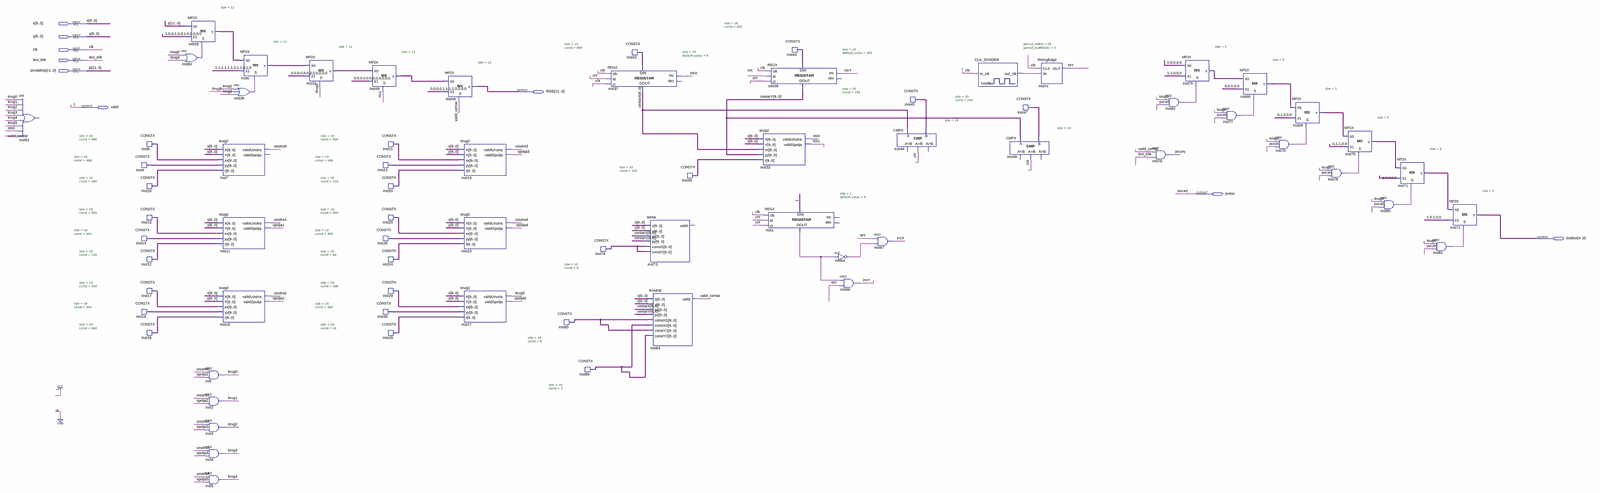
[diagram p0: schematic sheet, whole]
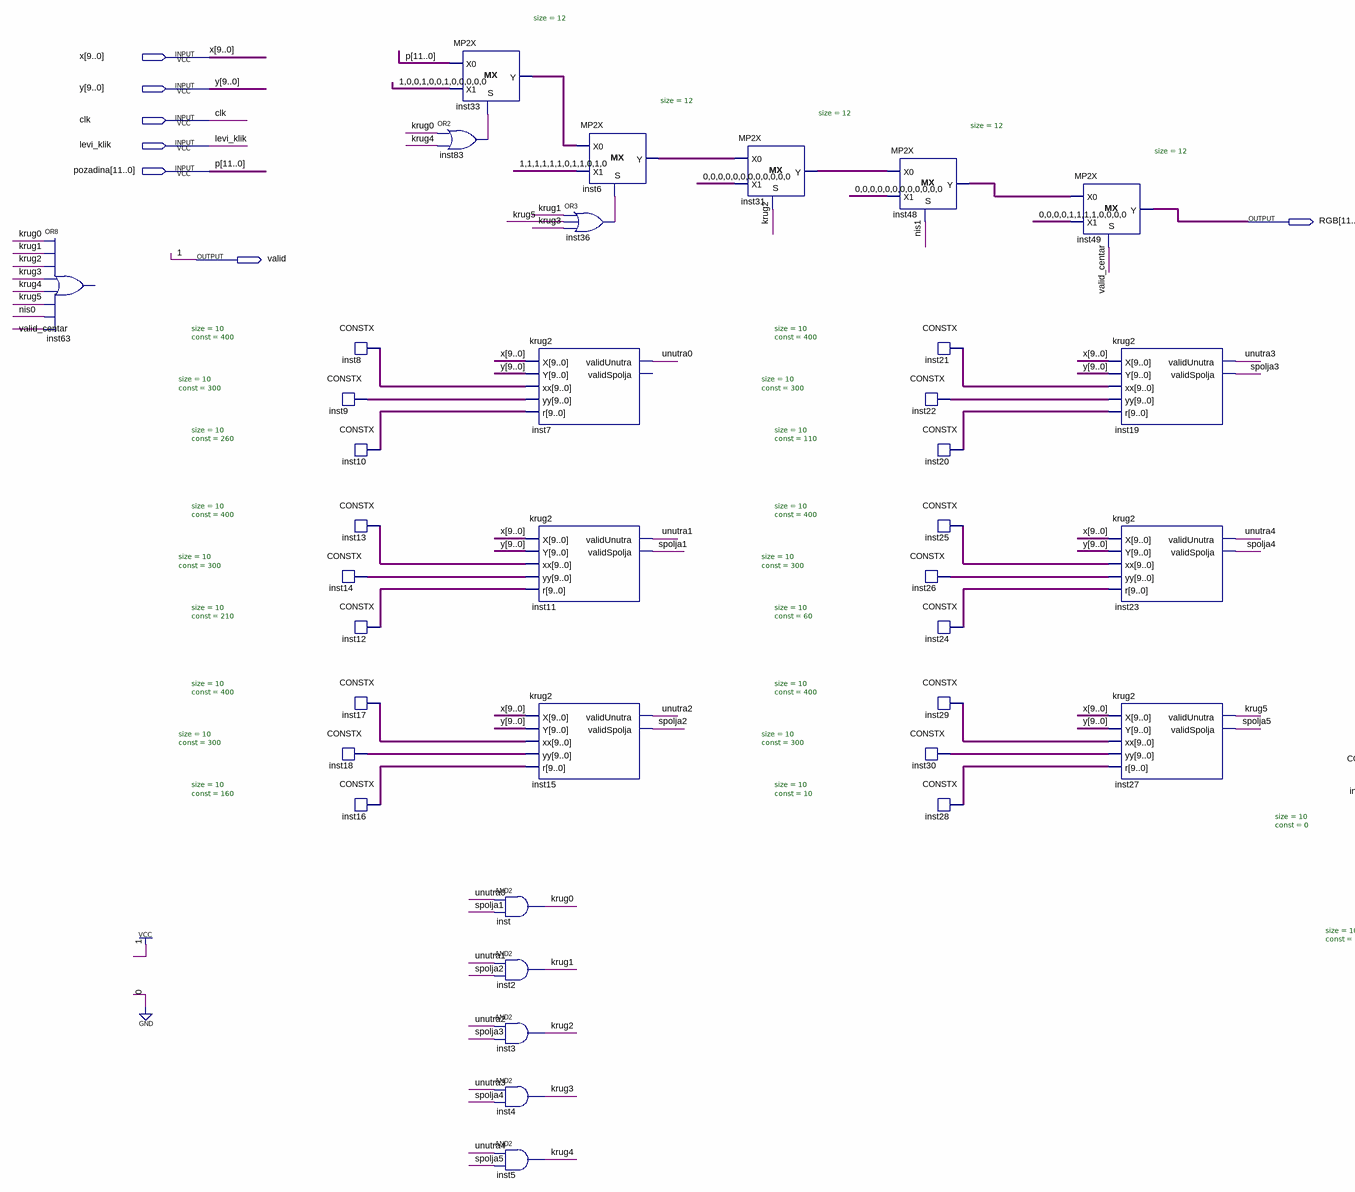
[diagram p1: schematic sheet, left part]
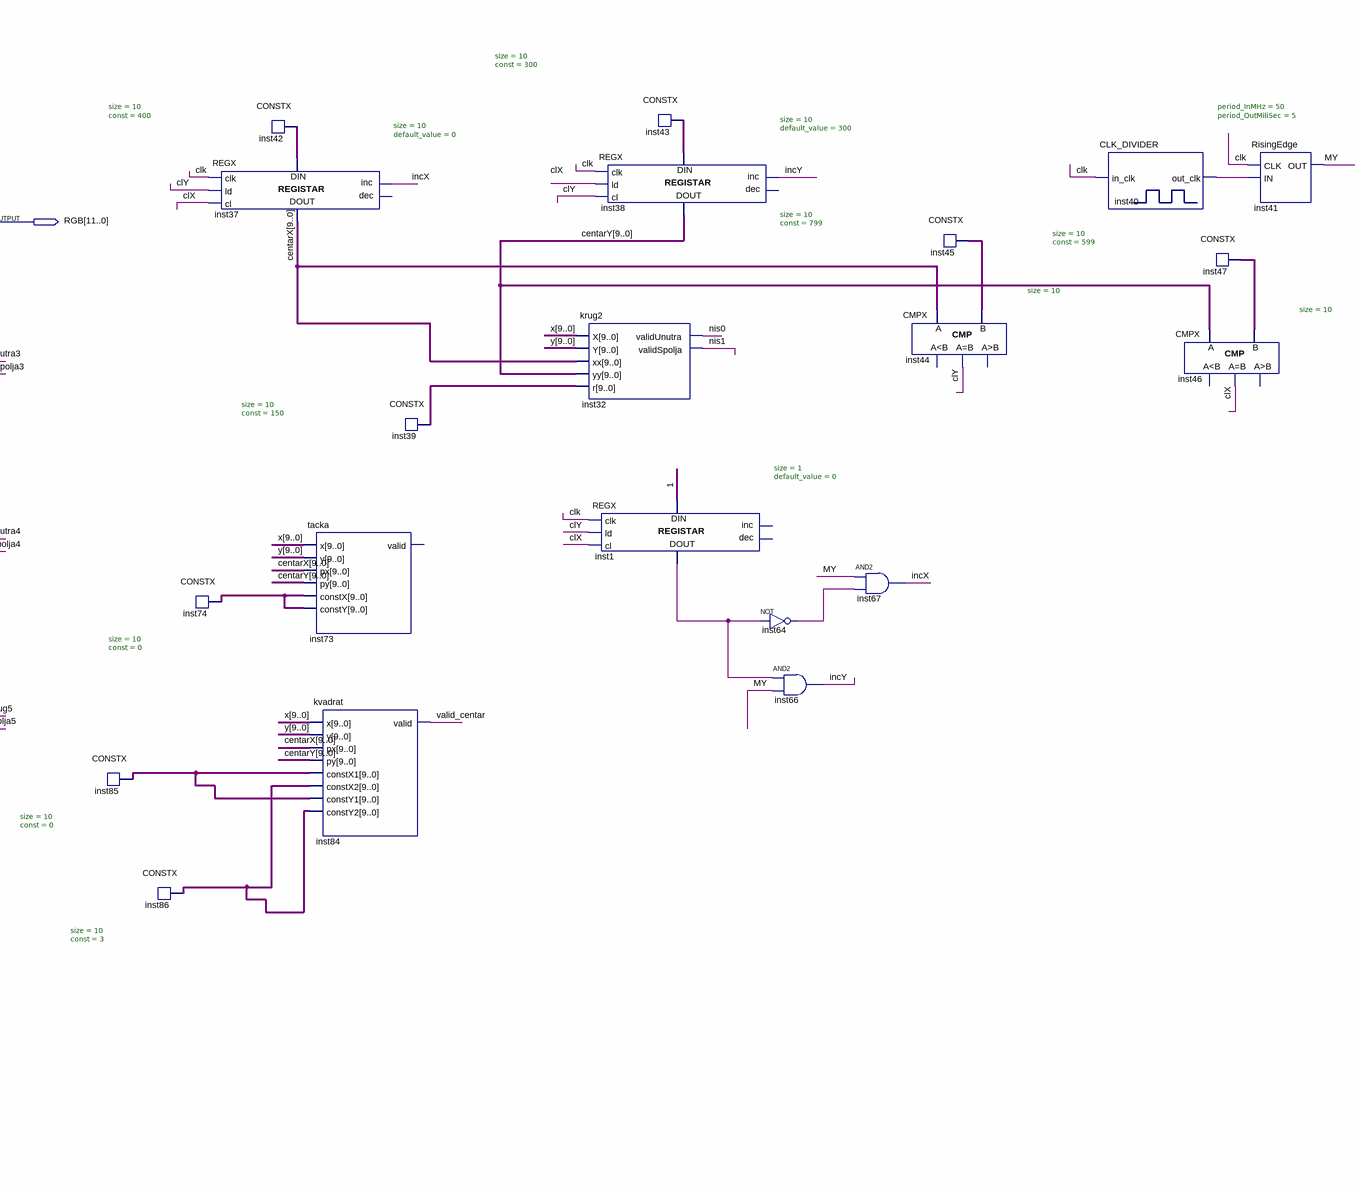
[diagram p2: schematic sheet, centre part]
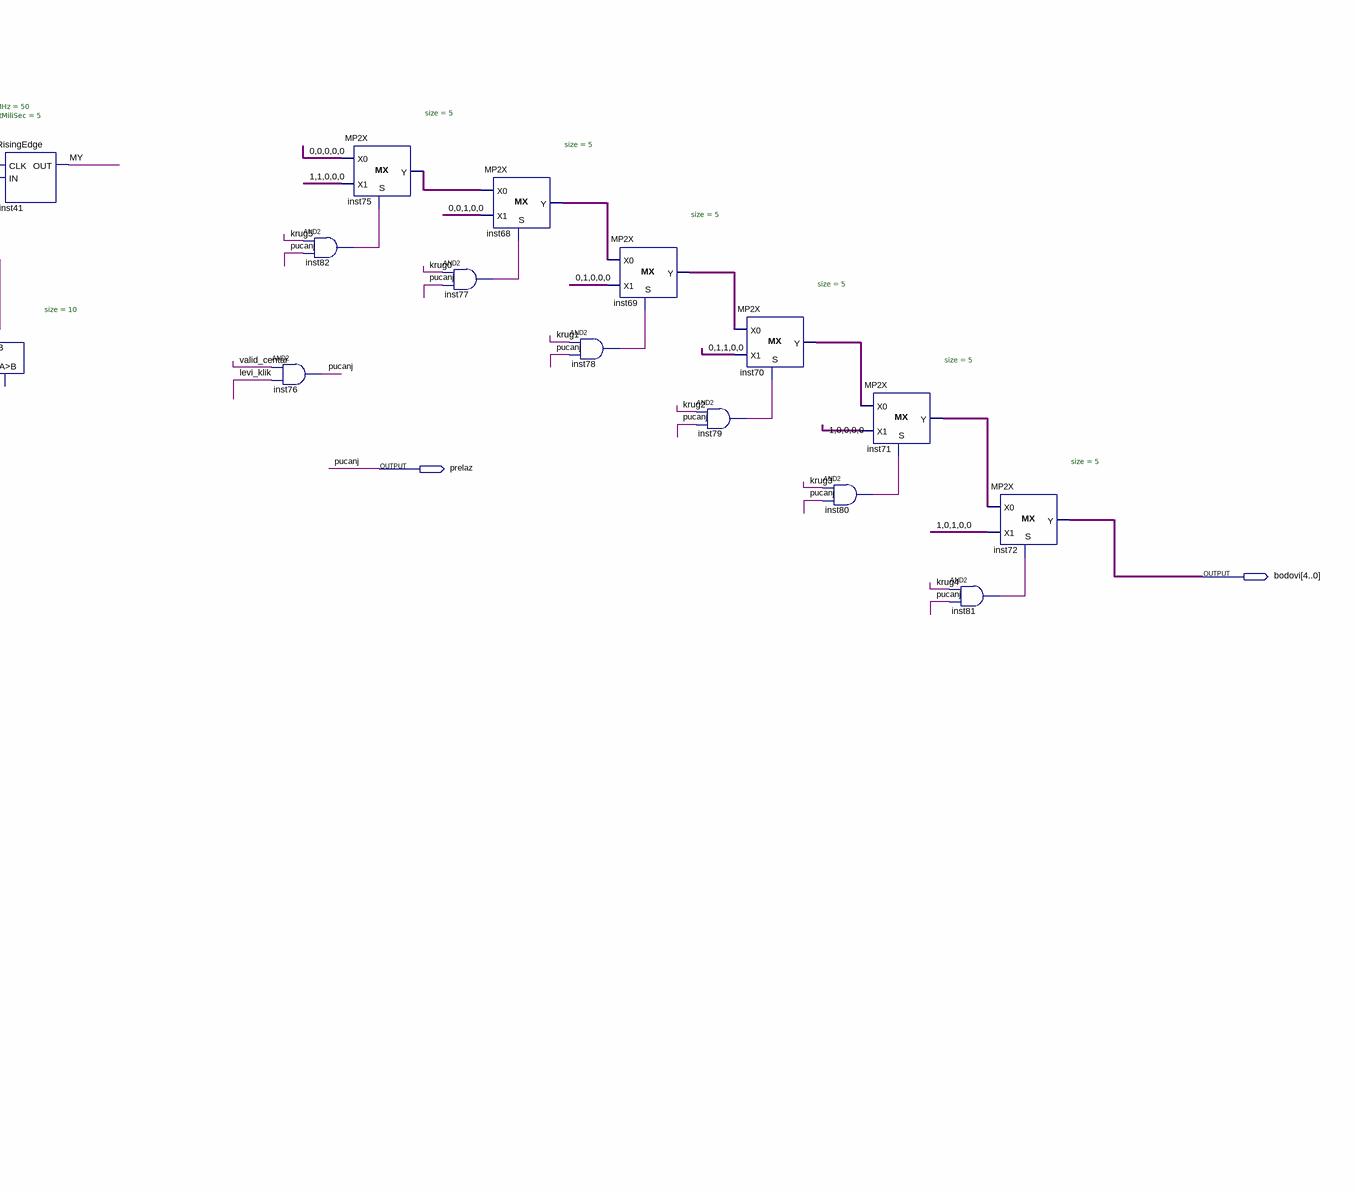
[diagram p3: schematic sheet, right part]
// Quartus schematic sestinivo.bdf as structural Verilog: 71 symbols, 9 pins
module sestinivo (
  input  [9:0] x,
  input  [9:0] y,
  input  clk,
  input  levi_klik,
  input  [11:0] pozadina,
  output [11:0] RGB,
  output valid,
  output prelaz,
  output [4:0] bodovi
);

  wire clX, clY, incX, incY, inst1_data_out, inst36_out, inst40_out_clk, inst64_out, inst77_out, inst78_out,
       inst79_out, inst80_out, inst81_out, inst82_out, inst83_out, krug0, krug1, krug2, krug3, krug4, krug5,
       MY, nis0, nis1, spolja1, spolja2, spolja3, spolja4, spolja5, unutra0, unutra1, unutra2, unutra3,
       unutra4, valid_centar;
  wire [4:0] inst68_y, inst69_y, inst70_y, inst71_y, inst75_y;
  wire [9:0] centarX, centarY, inst8_data, inst9_data, inst10_data, inst12_data, inst13_data, inst14_data,
       inst16_data, inst17_data, inst18_data, inst20_data, inst21_data, inst22_data, inst24_data,
       inst25_data, inst26_data, inst28_data, inst29_data, inst30_data, inst39_data, inst42_data,
       inst43_data, inst45_data, inst47_data, inst74_data, inst85_data, inst86_data;
  wire [11:0] inst6_y, inst31_y, inst33_y, inst48_y;

  // OR8 inst63 has open pins: IN1=krug0, IN2=krug1, IN3=krug2, IN4=krug3, IN5=krug4, IN6=krug5, IN7=nis0, IN8=valid_centar, OUT=open
  CONSTX #(.size(10), .\const (400)) inst8 (.data(inst8_data));
  CONSTX #(.size(10), .\const (300)) inst9 (.data(inst9_data));
  CONSTX #(.size(10), .\const (260)) inst10 (.data(inst10_data));
  CONSTX #(.size(10), .\const (400)) inst13 (.data(inst13_data));
  CONSTX #(.size(10), .\const (300)) inst14 (.data(inst14_data));
  CONSTX #(.size(10), .\const (210)) inst12 (.data(inst12_data));
  CONSTX #(.size(10), .\const (400)) inst17 (.data(inst17_data));
  CONSTX #(.size(10), .\const (300)) inst18 (.data(inst18_data));
  CONSTX #(.size(10), .\const (160)) inst16 (.data(inst16_data));
  or inst83 (inst83_out, krug0, krug4);
  MP2X #(.size(12)) inst33 (.S(inst83_out), .X0(pozadina), .X1(12'b100100100000), .Y(inst33_y));
  and inst (krug0, unutra0, spolja1);
  and inst2 (krug1, unutra1, spolja2);
  and inst3 (krug2, unutra2, spolja3);
  and inst4 (krug3, unutra3, spolja4);
  and inst5 (krug4, unutra4, spolja5);
  krug2 inst7 (
    .X(x), .Y(y), .xx(inst8_data), .yy(inst9_data), .r(inst10_data), .validUnutra(unutra0));  // open: validSpolja
  krug2 inst11 (
    .X(x), .Y(y), .xx(inst13_data), .yy(inst14_data), .r(inst12_data), .validUnutra(unutra1),
    .validSpolja(spolja1));
  krug2 inst15 (
    .X(x), .Y(y), .xx(inst17_data), .yy(inst18_data), .r(inst16_data), .validUnutra(unutra2),
    .validSpolja(spolja2));
  MP2X #(.size(12)) inst6 (.S(inst36_out), .X0(inst33_y), .X1(12'b111111011010), .Y(inst6_y));
  or inst36 (inst36_out, krug1, krug5, krug3);
  MP2X #(.size(12)) inst31 (.S(krug2), .X0(inst6_y), .X1({12{1'b0}}), .Y(inst31_y));
  MP2X #(.size(12)) inst48 (.S(nis1), .X0(inst31_y), .X1({12{1'b0}}), .Y(inst48_y));
  CONSTX #(.size(10), .\const (400)) inst21 (.data(inst21_data));
  CONSTX #(.size(10), .\const (300)) inst22 (.data(inst22_data));
  CONSTX #(.size(10), .\const (110)) inst20 (.data(inst20_data));
  CONSTX #(.size(10), .\const (400)) inst25 (.data(inst25_data));
  CONSTX #(.size(10), .\const (300)) inst26 (.data(inst26_data));
  CONSTX #(.size(10), .\const (60)) inst24 (.data(inst24_data));
  CONSTX #(.size(10), .\const (400)) inst29 (.data(inst29_data));
  CONSTX #(.size(10), .\const (300)) inst30 (.data(inst30_data));
  CONSTX #(.size(10), .\const (10)) inst28 (.data(inst28_data));
  MP2X #(.size(12)) inst49 (.S(valid_centar), .X0(inst48_y), .X1(12'b000011110000), .Y(RGB));
  krug2 inst19 (
    .X(x), .Y(y), .xx(inst21_data), .yy(inst22_data), .r(inst20_data), .validUnutra(unutra3),
    .validSpolja(spolja3));
  krug2 inst23 (
    .X(x), .Y(y), .xx(inst25_data), .yy(inst26_data), .r(inst24_data), .validUnutra(unutra4),
    .validSpolja(spolja4));
  krug2 inst27 (
    .X(x), .Y(y), .xx(inst29_data), .yy(inst30_data), .r(inst28_data), .validUnutra(krug5),
    .validSpolja(spolja5));
  CONSTX #(.size(10), .\const (0)) inst85 (.data(inst85_data));
  CONSTX #(.size(10), .\const (3)) inst86 (.data(inst86_data));
  CONSTX #(.size(10), .\const (0)) inst74 (.data(inst74_data));
  CONSTX #(.size(10), .\const (400)) inst42 (.data(inst42_data));
  REGX #(.size(10), .default_value(0)) inst37 (
    .clk(clk), .ld(clY), .cl(clX), .inc(incX), .data_in(inst42_data), .data_out(centarX));  // open: dec
  tacka inst73 (.x(x), .y(y), .px(centarX), .py(centarY), .constX(inst74_data), .constY(inst74_data));  // open: valid
  kvadrat inst84 (
    .x(x), .y(y), .px(centarX), .py(centarY), .constX1(inst85_data), .constX2(inst86_data),
    .constY1(inst85_data), .constY2(inst86_data), .valid(valid_centar));
  CONSTX #(.size(10), .\const (150)) inst39 (.data(inst39_data));
  REGX #(.size(10), .default_value(300)) inst38 (
    .clk(clk), .ld(clX), .cl(clY), .inc(incY), .data_in(inst43_data), .data_out(centarY));  // open: dec
  krug2 inst32 (.X(x), .Y(y), .xx(centarX), .yy(centarY), .r(inst39_data), .validUnutra(nis0), .validSpolja(nis1));
  REGX #(.size(1), .default_value(0)) inst1 (
    .clk(clk), .ld(clY), .cl(clX), .data_in(1'b1), .data_out(inst1_data_out));  // open: inc, dec
  CONSTX #(.size(10), .\const (300)) inst43 (.data(inst43_data));
  not inst64 (inst64_out, inst1_data_out);
  and inst66 (incY, inst1_data_out, MY);
  and inst67 (incX, MY, inst64_out);
  CMPX #(.size(10)) inst44 (.A(centarX), .B(inst45_data), .eq(clY));  // open: ls, gr
  CONSTX #(.size(10), .\const (799)) inst45 (.data(inst45_data));
  CLK_DIVIDER #(.period_InMHz(50), .period_OutMiliSec(5)) inst40 (.in_clk(clk), .out_clk(inst40_out_clk));
  CONSTX #(.size(10), .\const (599)) inst47 (.data(inst47_data));
  CMPX #(.size(10)) inst46 (.A(centarY), .B(inst47_data), .eq(clX));  // open: ls, gr
  RisingEdge inst41 (.CLK(clk), .IN(inst40_out_clk), .OUT(MY));
  and inst82 (inst82_out, krug5, prelaz);
  and inst76 (prelaz, valid_centar, levi_klik);
  MP2X #(.size(5)) inst75 (.S(inst82_out), .X0({5{1'b0}}), .X1(5'b11000), .Y(inst75_y));
  and inst77 (inst77_out, krug0, prelaz);
  MP2X #(.size(5)) inst68 (.S(inst77_out), .X0(inst75_y), .X1(5'b00100), .Y(inst68_y));
  and inst78 (inst78_out, krug1, prelaz);
  MP2X #(.size(5)) inst69 (.S(inst78_out), .X0(inst68_y), .X1(5'b01000), .Y(inst69_y));
  and inst79 (inst79_out, krug2, prelaz);
  MP2X #(.size(5)) inst70 (.S(inst79_out), .X0(inst69_y), .X1(5'b01100), .Y(inst70_y));
  and inst80 (inst80_out, krug3, prelaz);
  MP2X #(.size(5)) inst71 (.S(inst80_out), .X0(inst70_y), .X1(5'b10000), .Y(inst71_y));
  and inst81 (inst81_out, krug4, prelaz);
  MP2X #(.size(5)) inst72 (.S(inst81_out), .X0(inst71_y), .X1(5'b10100), .Y(bodovi));

  assign valid = 1'b1;

  // Other names for the same wires on the sheet: p[11:0] = pozadina; pucanj = prelaz
endmodule
